# EAGLE design photogate-sos-v2-2022 (EAGLE 9.6.2)
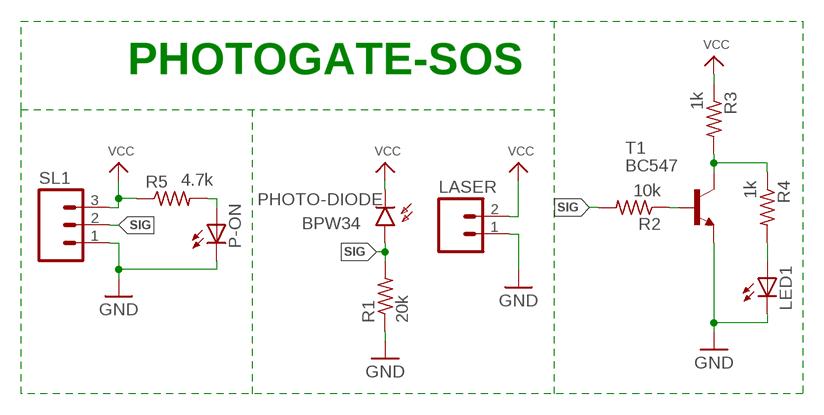
[diagram p0: schematic, sheet 1]

## Parts
LASER  M02  [02P]
LED1  LED3MM  [LED3MM]
P-ON  LED3MM  [LED3MM]
PHOTO-DIODE  BPW34  BPW32  [BPW32]
R1  20k  R-US_0204/7  [0204/7]
R2  10k  R-US_0204/7  [0204/7]
R3  1k  R-US_0204/7  [0204/7]
R4  1k  R-US_0204/7  [0204/7]
R5  4.7k  R-US_0204/7  [0204/7]
SL1  M03  [03P]
T1  BC547  [TO92]

## Nets
GND: LASER.1 LED1.K(C) P-ON.K(C) R1.1 SL1.1 T1.1(E)
N$1: R2.1 T1.2(B)
N$2: R3.2 R4.1 T1.3(C)
N$3: LED1.A R4.2
N$4: P-ON.A R5.2
SIG: PHOTO-DIODE.A R1.2 R2.2 SL1.2
VCC: LASER.2 PHOTO-DIODE.K(C) R3.1 R5.1 SL1.3

## Notes on the sheet
- PHOTOGATE-SOS

## Library data of the parts
LASER = CEDT_JANUARY_2015_v5:M02: AMP QUICK CONNECTOR
LED1 P-ON = CEDT_JANUARY_2015_v5:LED
PHOTO-DIODE = opto-trans-siemens:BPW32: PHOTO DIODE; OC_FARNELL: unknown; OC_NEWARK: unknown
R1-R5 = rcl:R-US_: RESISTOR, American symbol; SPICEPREFIX: R
SL1 = con-amp-quick:M03: AMP QUICK CONNECTOR; OC_FARNELL: unknown; OC_NEWARK: unknown
T1 = transistor:BC547: NPN TRANSISTOR

## Board
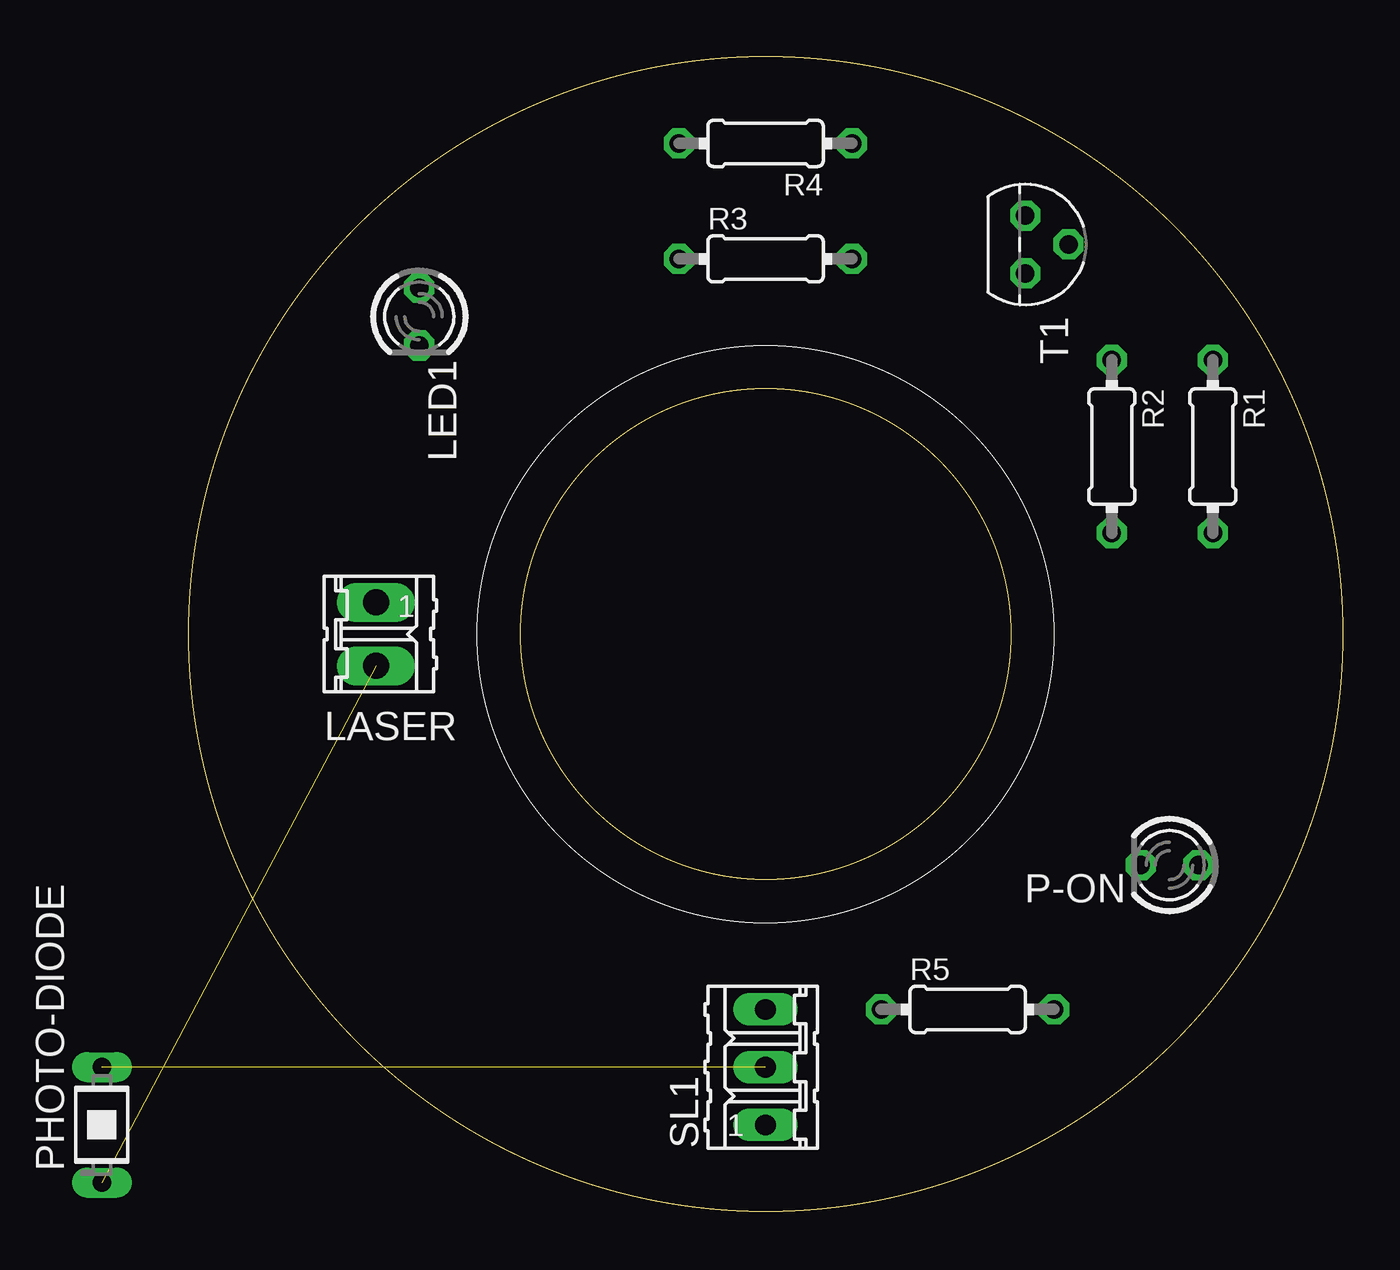
[diagram p1: board, top side]
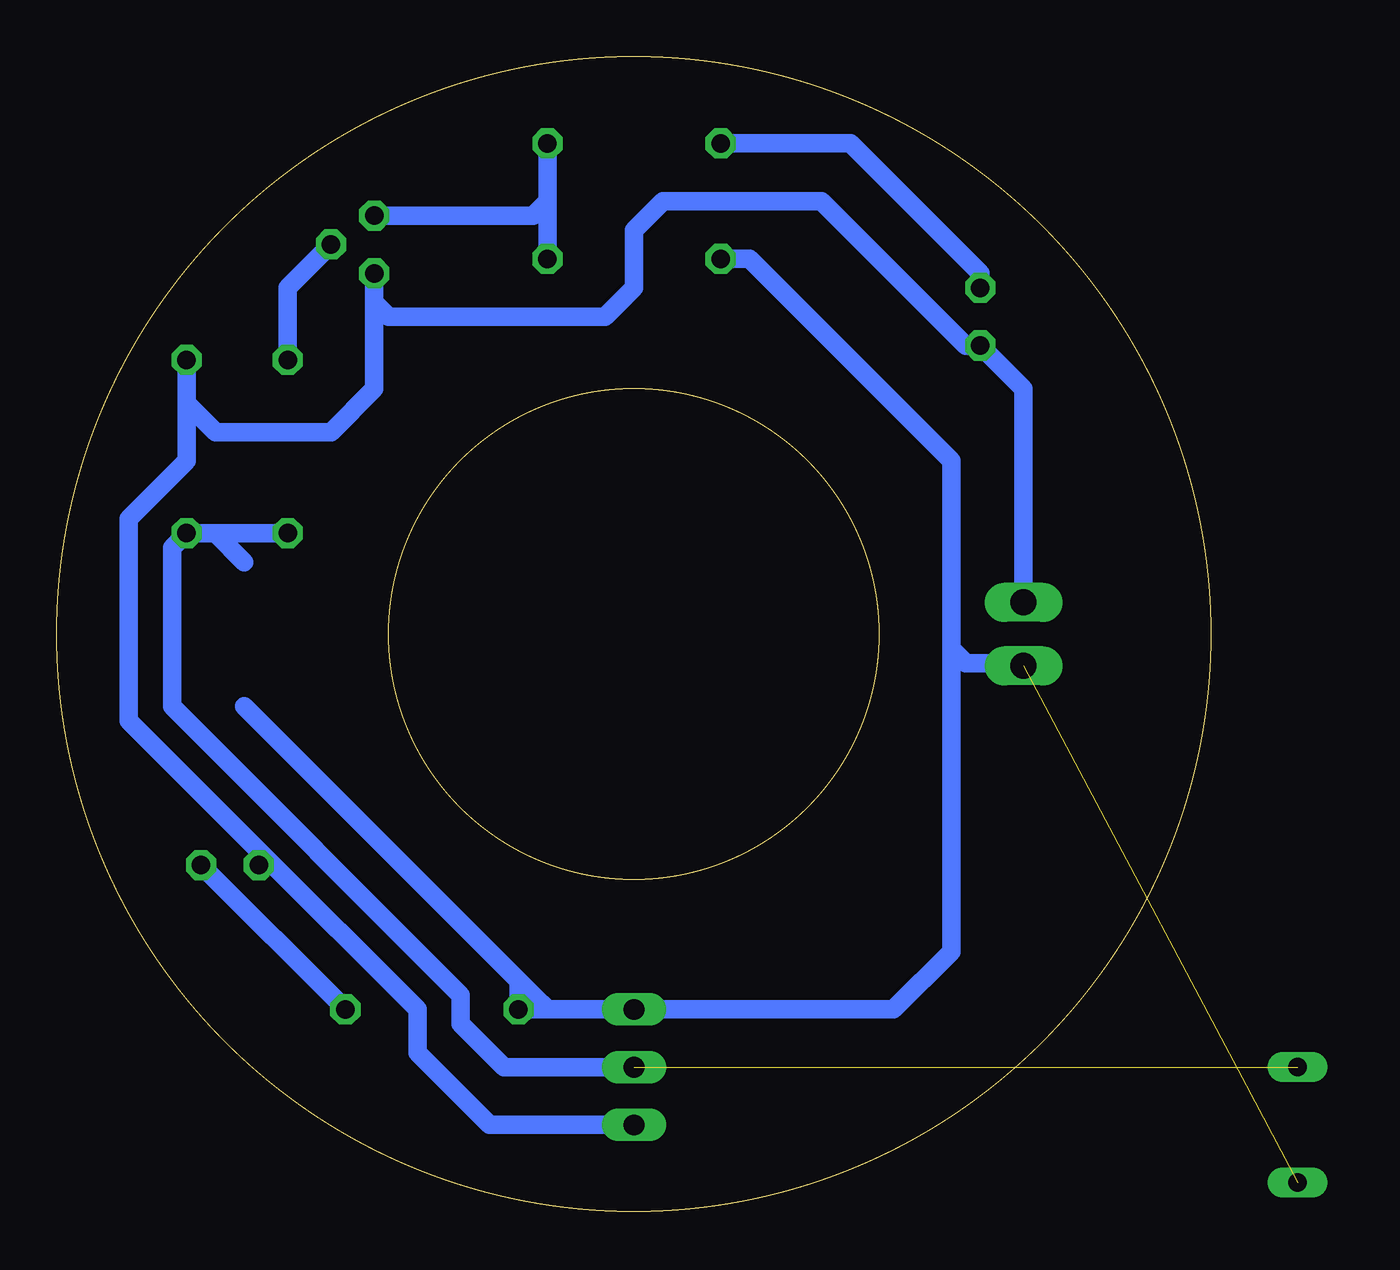
[diagram p2: board, bottom side, seen from below]

Size 50.8 x 50.8 mm. Coordinates in mm from the lower left corner, seen from the top.
Outline: circle at 25.4,25.4 radius 25.4
Outline: circle at 25.4,25.4 radius 10.79
Copper layers (1*16): Top 0.035mm / dielectric 1.5mm / Bottom 0.035mm
Design rules "default": minimum track width 6mil, minimum drill 0.35mm, track to track 6mil, track to pad 6mil, pad to pad 6mil, via to via 6mil, smd to smd 6mil, copper to edge 40mil, drill to drill 6mil, minimum pad ring 10mil, minimum via ring 8mil, stop-mask expansion 4mil, vias tented up to drill 0mil, thermal gap 10mil

### Footprints (pad centres in the part's own frame; a part is rotated, then mirrored left to right if it is on the bottom)
02P = drill 1.143 long: 1 -1.397,0; 2 1.397,0
LED3MM = drill 0.813 octagon: A -1.27,0; K 1.27,0
BPW32 = drill 0.813 long: A 0,2.54; K 0,-2.54
0204/7 = drill 0.813 octagon: 1 -3.81,0; 2 3.81,0
03P = drill 0.914 long: 1 -2.54,0; 2 0,0; 3 2.54,0
TO92 = drill 0.813 octagon: 1 1.27,0; 2 0,1.905; 3 -1.27,0

### Placement (x,y rotation side)
LASER  8.25,25.4 270 top
LED1  10.16,39.37 270 top
P-ON  43.18,15.24 180 top
PHOTO-DIODE  -3.81,3.81 0 top  (outside the outline)
R1  45.08,33.66 270 top
R2  40.64,33.66 270 top
R3  25.4,41.91 0 top
R4  25.4,46.99 180 top
R5  34.29,8.89 0 top
SL1  25.4,6.35 90 top
T1  36.83,42.55 270 top

### Tracks (layer width: path | path; a pad name or v marks a point on that pad's centre or on a via)
GND
  Bottom 0.813: 36.83,40 36.2,39.37 26.67,39.37 25.4,40.64 25.4,43.18 24.13,44.45 17.14,44.45 10.79,38.1 LED1.K 8.25,36.2 LASER.1 | T1.1 36.83,40 | 41.91,15.87 P-ON.K | 41.91,15.87 47.62,21.59 47.62,30.48 45.08,33.02 R1.1 45.08,35.56 43.81,34.29 38.73,34.29 36.83,36.2 36.83,40 | SL1.1 31.75,3.81 34.92,6.98 34.92,8.89 41.91,15.87
N$1
  Bottom 0.813: T1.2 40.64,40.64 R2.1
N$2
  Bottom 0.813: R4.1 29.21,44.45 | 29.21,44.45 R3.2 | T1.3 29.84,43.81 29.21,44.45
N$3
  Bottom 0.813: LED1.A 10.16,41.27 15.87,46.99 R4.2
N$4
  Bottom 0.813: P-ON.A R5.2
SIG  (1 unrouted)
  Bottom 0.813: R2.2 43.81,29.84 | 43.81,29.84 R1.2 45.72,29.21 45.72,22.22 33.02,9.52 33.02,8.25 31.11,6.35 SL1.2 | 42.55,28.57 43.81,29.84
VCC  (1 unrouted)
  Bottom 0.813: 11.43,24.76 10.79,24.13 8.38,24.13 LASER.2 | R3.1 20.32,41.91 11.43,33.02 11.43,24.76 | 42.55,22.22 30.48,10.16 | 30.48,10.16 30.48,9.52 | 30.48,9.52 R5.1 29.21,8.89 | 29.21,8.89 SL1.3 13.97,8.89 11.43,11.43 11.43,24.76 | 30.48,9.52 29.84,9.52 | 29.84,9.52 29.21,8.89 | 30.48,10.16 29.84,9.52